# Altium schematic sheet E16-02-002.SchDoc
size A4
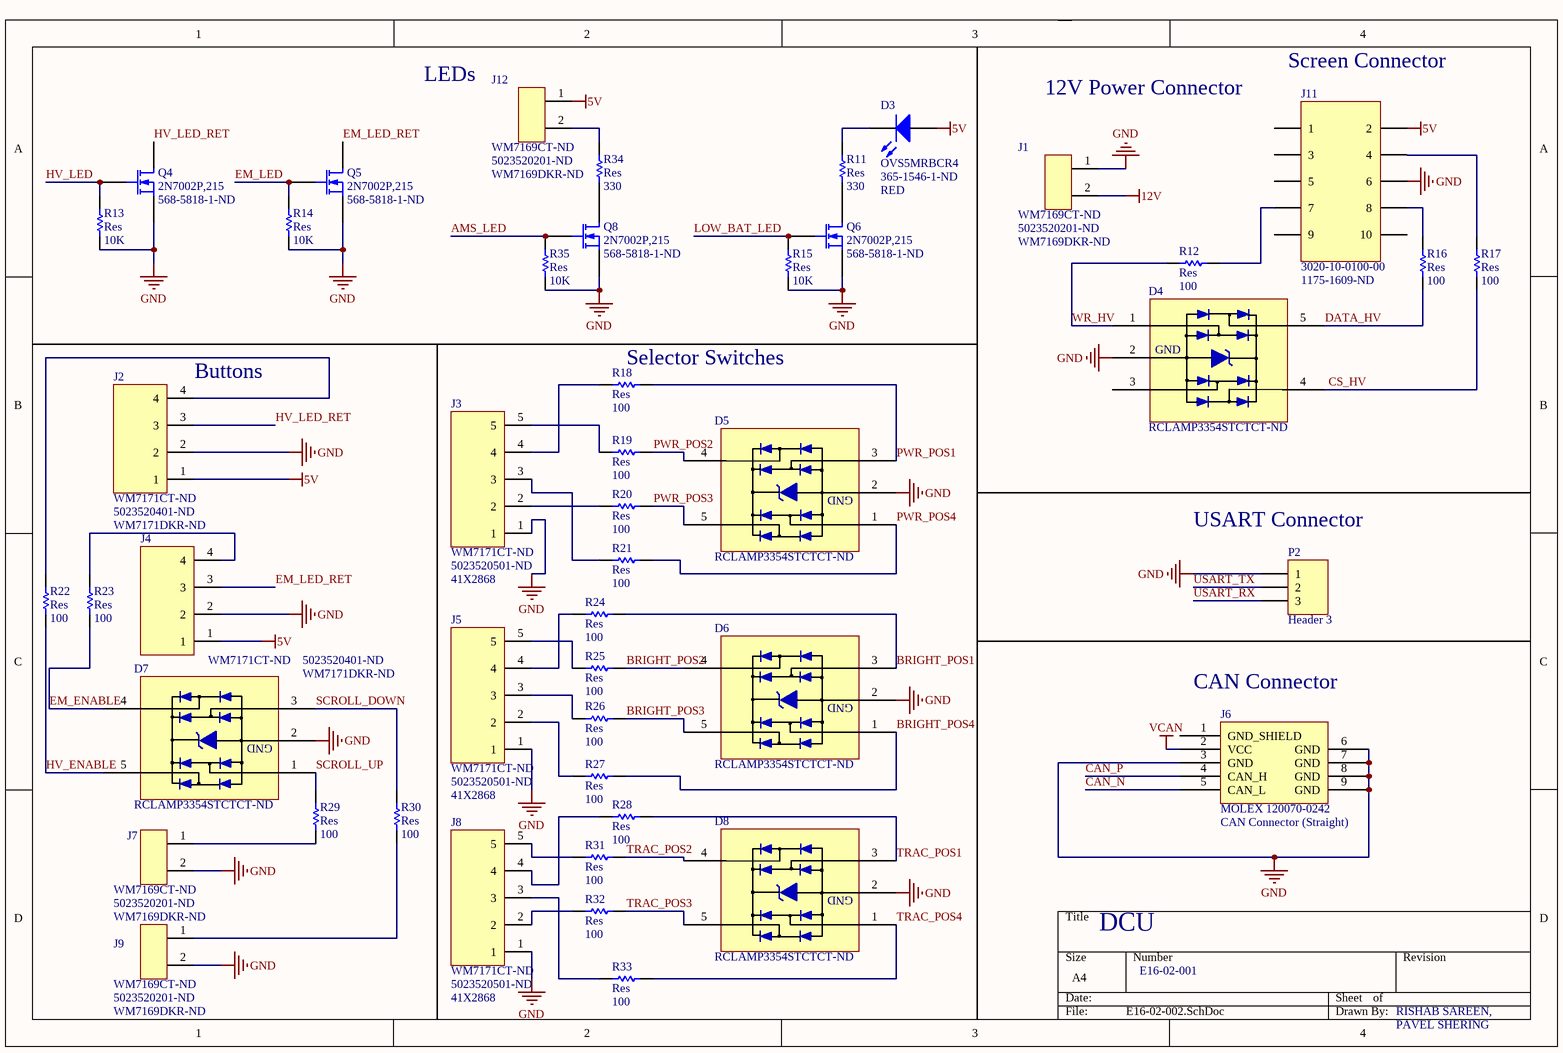
[diagram p0: E16-02-002.SchDoc]

## Parts
D3  OVS5MRBCR4  Supplier Part Number 1: 365-1546-1-ND  Colour: RED  [OVS5MRBCR4]
D4  Supplier Part Number 1: RCLAMP3354STCTCT-ND  [SOT95P280X145-5N]  (hidden comment: RCLAMP3354S.TCT)
D5  Supplier Part Number 1: RCLAMP3354STCTCT-ND  [SOT95P280X145-5N]  (hidden comment: RCLAMP3354S.TCT)
D6  Supplier Part Number 1: RCLAMP3354STCTCT-ND  [SOT95P280X145-5N]  (hidden comment: RCLAMP3354S.TCT)
D7  Supplier Part Number 1: RCLAMP3354STCTCT-ND  [SOT95P280X145-5N]  (hidden comment: RCLAMP3354S.TCT)
D8  Supplier Part Number 1: RCLAMP3354STCTCT-ND  [SOT95P280X145-5N]  (hidden comment: RCLAMP3354S.TCT)
J1  Supplier Part Number 1: 5023520201-ND  Supplier Part Number 2: WM7169DKR-ND  [MOLEX_DURACLIK_2]  (hidden comment: J_5023520200)
J2  Supplier Part Number 1: 5023520401-ND  Supplier Part Number 2: WM7171DKR-ND  [MOLEX_DURACLIK_4]  (hidden comment: WM7171CT-ND)
J3  Supplier Part Number 1: 5023520501-ND  Supplier Part Number 2: 41X2868  [MOLEX_DURACLIK_5]  (hidden comment: WM7171CT-ND)
J4  Supplier Part Number 1: 5023520401-ND  Supplier Part Number 2: WM7171DKR-ND  [MOLEX_DURACLIK_4]  (hidden comment: WM7171CT-ND)
J5  Supplier Part Number 1: 5023520501-ND  Supplier Part Number 2: 41X2868  [MOLEX_DURACLIK_5]  (hidden comment: WM7171CT-ND)
J6  CAN Connector (Straight)  [CAN Connector (Straight)]
J7  Supplier Part Number 1: 5023520201-ND  Supplier Part Number 2: WM7169DKR-ND  [MOLEX_DURACLIK_2]  (hidden comment: J_5023520200)
J8  Supplier Part Number 1: 5023520501-ND  Supplier Part Number 2: 41X2868  [MOLEX_DURACLIK_5]  (hidden comment: WM7171CT-ND)
J9  Supplier Part Number 1: 5023520201-ND  Supplier Part Number 2: WM7169DKR-ND  [MOLEX_DURACLIK_2]  (hidden comment: J_5023520200)
J11  3020-10-0100-00  Supplier Part Number 1: 1175-1609-ND  [IDC 10 Pos]
J12  Supplier Part Number 1: 5023520201-ND  Supplier Part Number 2: WM7169DKR-ND  [MOLEX_DURACLIK_2]  (hidden comment: J_5023520200)
P2  Header 3  [HDR1X3]
Q4  2N7002P,215  Supplier Part Number 1: 568-5818-1-ND  [SOT23-3]
Q5  2N7002P,215  Supplier Part Number 1: 568-5818-1-ND  [SOT23-3]
Q6  2N7002P,215  Supplier Part Number 1: 568-5818-1-ND  [SOT23-3]
Q8  2N7002P,215  Supplier Part Number 1: 568-5818-1-ND  [SOT23-3]
R11  Res  value 330  [3216[1206]]
R12  Res  value 100  [3216[1206]]
R13  Res  value 10K  [3216[1206]]
R14  Res  value 10K  [3216[1206]]
R15  Res  value 10K  [3216[1206]]
R16  Res  value 100  [3216[1206]]
R17  Res  value 100  [3216[1206]]
R18  Res  value 100  [3216[1206]]
R19  Res  value 100  [3216[1206]]
R20  Res  value 100  [3216[1206]]
R21  Res  value 100  [3216[1206]]
R22  Res  value 100  [3216[1206]]
R23  Res  value 100  [3216[1206]]
R24  Res  value 100  [3216[1206]]
R25  Res  value 100  [3216[1206]]
R26  Res  value 100  [3216[1206]]
R27  Res  value 100  [3216[1206]]
R28  Res  value 100  [3216[1206]]
R29  Res  value 100  [3216[1206]]
R30  Res  value 100  [3216[1206]]
R31  Res  value 100  [3216[1206]]
R32  Res  value 100  [3216[1206]]
R33  Res  value 100  [3216[1206]]
R34  Res  value 330  [3216[1206]]
R35  Res  value 10K  [3216[1206]]

## Nets
5V: D3.1(A) J2.1 J4.1 J11.2 J12.1
12V: J1.2
GND: D4.2(GND) D5.2(GND) D6.2(GND) D7.2(GND) D8.2(GND) J1.1 J2.2 J3.1 J4.2 J5.1 J6.3(GND) J6.6(GND) J6.7(GND) J6.8(GND) J6.9(GND) J7.2 J8.1 J9.2 J11.6 P2.1 Q4.2(S) Q5.2(S) Q6.2(S) Q8.2(S) R13.1 R14.1 R15.1 R35.1
VCAN: J6.2(VCC)
AMS_LED: Q8.1(G) R35.2
BRIGHT_POS1: D6.3 R24.1
BRIGHT_POS2: D6.4 R25.2
BRIGHT_POS3: D6.5 R26.2
BRIGHT_POS4: D6.1 R27.1
CAN_N: J6.5(CAN_L)
CAN_P: J6.4(CAN_H)
CS_HV: D4.4 R17.1
DATA_HV: D4.5 R16.1
EM_ENABLE: D7.4 R23.1
EM_LED: Q5.1(G) R14.2
EM_LED_RET: J4.3 Q5.3(D)
HV_ENABLE: D7.5 R22.1
HV_LED: Q4.1(G) R13.2
HV_LED_RET: J2.3 Q4.3(D)
LOW_BAT_LED: Q6.1(G) R15.2
PWR_POS1: D5.3 R18.1
PWR_POS2: D5.4 R19.1
PWR_POS3: D5.5 R20.2
PWR_POS4: D5.1 R21.1
SCROLL_DOWN: D7.3 R30.2
SCROLL_UP: D7.1 R29.1
TRAC_POS1: D8.3 R28.1
TRAC_POS2: D8.4 R31.2
TRAC_POS3: D8.5 R32.2
TRAC_POS4: D8.1 R33.1
USART_RX: P2.3
USART_TX: P2.2
WR_HV: D4.1 R12.1
NetD3_2: D3.2(K) R11.2
NetJ2_4: J2.4 R22.2
NetJ3_2: J3.2 R20.1
NetJ3_3: J3.3 R21.2
NetJ3_4: J3.4 R18.2
NetJ3_5: J3.5 R19.2
NetJ4_4: J4.4 R23.2
NetJ5_2: J5.2 R27.2
NetJ5_3: J5.3 R26.1
NetJ5_4: J5.4 R24.2
NetJ5_5: J5.5 R25.1
NetJ7_1: J7.1 R29.2
NetJ8_2: J8.2 R32.1
NetJ8_3: J8.3 R33.2
NetJ8_4: J8.4 R28.2
NetJ8_5: J8.5 R31.1
NetJ9_1: J9.1 R30.1
NetJ11_4: J11.4 R17.2
NetJ11_7: J11.7 R12.2
NetJ11_8: J11.8 R16.2
NetJ12_2: J12.2 R34.2
NetQ6_3: Q6.3(D) R11.1
NetQ8_3: Q8.3(D) R34.1

Not connected (* = marked no-connect by the designer): D4 3; J6 1(GND_SHIELD); J11 1 3 5 9 10

## Notes on the sheet
- LEDs
- 12V Power Connector
- Screen Connector
- (near J2) Buttons
- (near R18) Selector Switches
- (near P2) USART Connector
- (near J6) CAN Connector
- DCU
- E16-02-001
- RISHAB SAREEN,
- PAVEL SHERING
- (in symbol CAN Connector (Straight)) MOLEX 120070-0242

## Library data of the parts
D3 = OVS5MRBCR4: Typical RED LED; Published: 8-Jun-2000; LatestRevisionDate: 17-Jul-2002; LatestRevisionNote: Re-released for DXP Platform.; PackageDocument: Feb-2002; PackageReference: 3.2X1.6X1.1; Publisher: Altium Limited; Supplier 1: Digi-Key
D4-D8 = RCLAMP3354S.TCT: TVS DIODE 3.3VWM 16VC; Supplier 1: Digi-Key
J1 J7 J9 J12 = J_5023520200: MOLEX DURACLIK 2-PIN RA; Digikey_PN: WM7169CT-ND; Supplier 1: Digi-Key; Supplier 2: Digi-Key
J2 J4 = J_5023520400: MOLEX DURACLIK 4-PIN RA; Supplier 1: Digi-Key; Supplier 2: Digi-Key; Digikey_PN: WM7171CT-ND
J3 J5 J8 = J_5023520500: MOLEX DURACLIK 5-PIN RA; Supplier 1: Digi-Key; Supplier 2: Newark; Digikey_PN: WM7171CT-ND
J11 = IDC_10Pos: Supplier 1: Digi-Key
P2 = Header 3: Header, 3-Pin; LatestRevisionDate: 17-Jul-2002; LatestRevisionNote: Re-released for DXP Platform.; Publisher: Altium Limited
Q4-Q6 Q8 = 2N7002P,215: N-Channel Enhancement Mode Vertical DMOS FET; PackageReference: SOT23; PackageDescription: SOT-23; 3 Leads; Body 3.1 x 2.5 mm, inc. leads (LxW max), Alternate Lead Configuration; Supplier 1: Digi-Key
R11-R35 = Res: Surface Mount Resistor; Published: 8-Jun-2000; LatestRevisionDate: 17-Jul-2002; LatestRevisionNote: Re-released for DXP Platform.; PackageReference: AXIAL-0.5; Publisher: Altium Limited
J6 = CAN Connector (Straight): Supplier 1: Mouser